# Altium project Wind_Power.PrjPCB
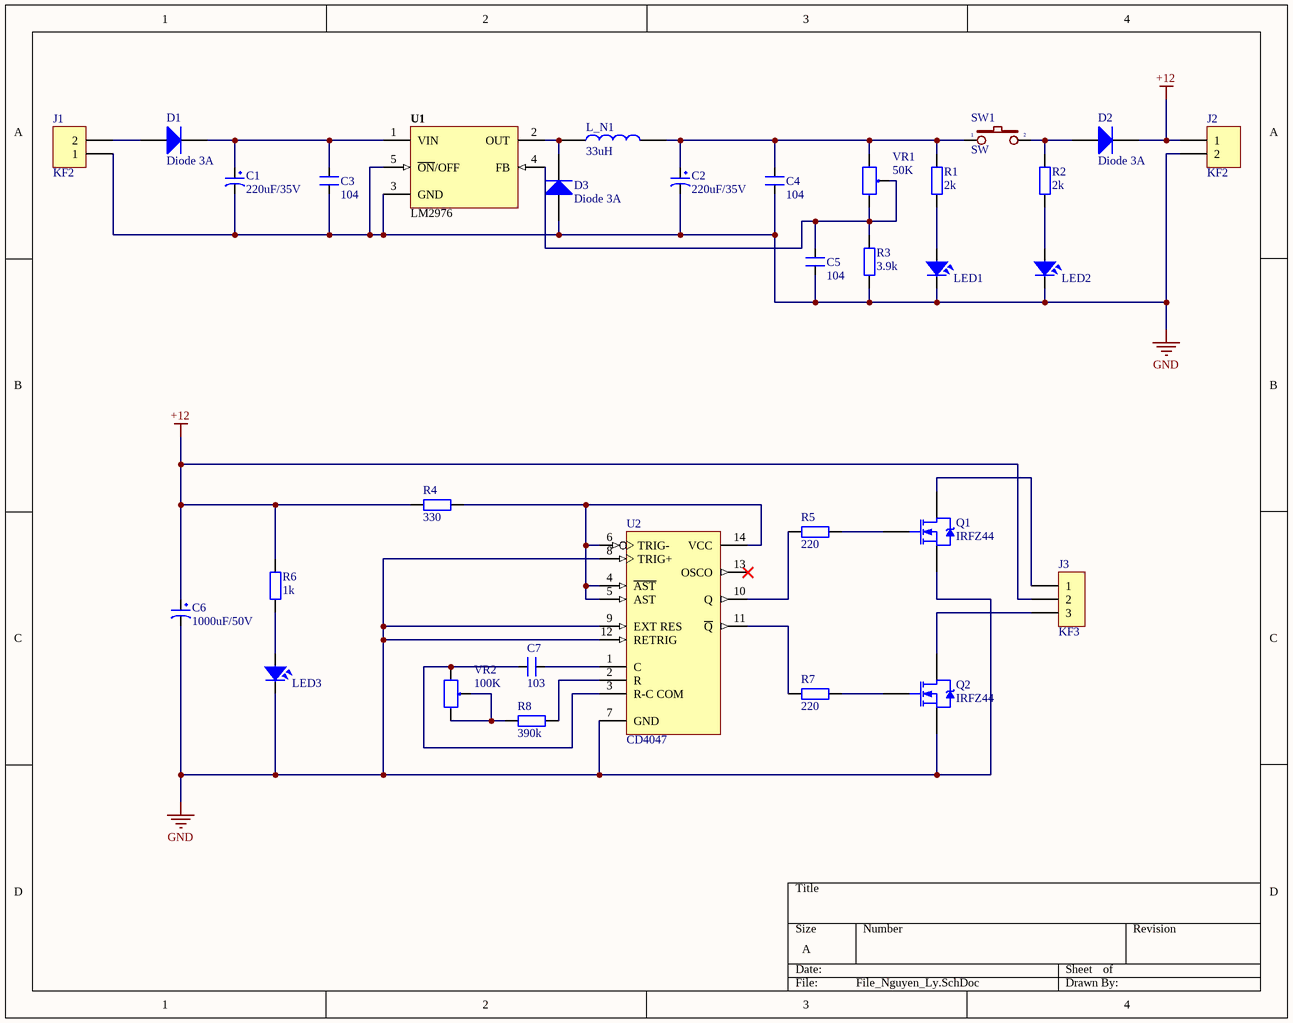
[diagram p0: File_Nguyen_Ly.SchDoc]
1 sheet, 32 parts. Net scope: global (net labels, ports and power ports of the same name join across sheets).
Board file: File_Mach_In.PcbDoc

## Sheet File_Nguyen_Ly.SchDoc
size A

### Parts
C1  220uF/35V  [CP1.5/3.4]
C2  220uF/35V  [CP1.5/3.4]
C3  104  [CN2]
C4  104  [CN2]
C5  104  [CN2]
C6  1000uF/50V  [CP2/4]
C7  103  [CN1.5]
D1  Diode 3A  [DIODE/POW/3A]
D2  Diode 3A  [DIODE/POW/3A]
D3  Diode 3A  [DIODE/POW/3A]
J1  KF2  [KF2-5.08]
J2  KF2  [KF2-7.62]
J3  KF3  [KF3-7.62]
L_N1  33uH  [100UH]
LED1  LED  [LED-5-Green]  (value not drawn)
LED2  LED  [LED-5-RED]  (value not drawn)
LED3  LED  [LED-5-BLUE]  (value not drawn)
Q1  IRFZ44  [TO220H2]
Q2  IRFZ44  [TO220H2]
R1  2k  [R1/4W]
R2  2k  [R1/4W]
R3  3.9k  [R1/4W]
R4  330  [R1/4W]
R5  220  [R1/2W]
R6  1k  [R1/4W]
R7  220  [R1/2W]
R8  390k  [R1/4W]
SW1  SW  [SW-DIP1-1]
U1  LM2976  [DIP5]
U2  CD4047  [DIP14/W0.3]
VR1  50K  [VR]
VR2  100K  [VR]

### Nets
+12: C6.1 D2.2(K) J2.1 J3.2 R4.2 R6.2
GND: C1.2 C2.2 C3.1 C4.1 C5.1 C6.2 D3.1(A) J1.1 J2.2 LED1.2 LED2.2 LED3.2 Q1.3(S) Q2.3(S) R3.1 U1.3(GND) U1.5(~{ON}/OFF) U2.7(GND) U2.8(TRIG+) U2.9(EXT_RES) U2.12(RETRIG)
NetC1_1: C1.1 C3.2 D1.2(K) U1.1(VIN)
NetC2_1: C2.1 C4.2 L_N1.2 R1.2 SW1.1 VR1.1
NetC5_2: C5.2 R3.2 U1.4(FB) VR1.2 VR1.3
NetC7_1: C7.1 U2.3(R-C_COM) VR2.1
NetC7_2: C7.2 U2.1(C)
NetD1_1: D1.1(A) J1.2
NetD2_1: D2.1(A) R2.2 SW1.2
NetD3_2: D3.2(K) L_N1.1 U1.2(OUT)
NetJ3_1: J3.1 Q1.2(D)
NetJ3_3: J3.3 Q2.2(D)
NetLED1_1: LED1.1 R1.1
NetLED2_1: LED2.1 R2.1
NetLED3_1: LED3.1 R6.1
NetQ1_1: Q1.1(G) R5.1
NetQ2_1: Q2.1(G) R7.1
NetR4_1: R4.1 U2.4(~{AST}) U2.5(AST) U2.6(TRIG-) U2.14(VCC)
NetR5_2: R5.2 U2.10(Q)
NetR7_2: R7.2 U2.11(~{Q})
NetR8_1: R8.1 U2.2(R)
NetR8_2: R8.2 VR2.2 VR2.3

Not connected (* = marked no-connect by the designer): U2 13(OSCO)*

### Library data of the parts
C1 C2 = CP3: Cap 100uF/35V - 470uF/16V; Value: 100uF/35V/50V; Description 1: 1000uF/6,3V - 470uF/16V - 330uF - 25V; Description 2: 220uF/35V - 100uF/50V - 63V - 4,7uF/200V; Description 3: 22uF => 33uF100V - 3,3uF => 4,7uF/250V; Description 4: 2,2uF =>3,3uF/350 - 2,2uF/400V - 1uF/450V
C3-C5 = CN2: Cap np 104 => 105pF; Value: 0.1uF
C6 = CP5: Cap 2200uF/16V - 1000uF/50V; Description 5: 47uF/200V - 22uF/350V - 400V - 10uF/450V; Description 1: 4700uF-6800uF/6,3V - 3300uF-4700uF/10V; Description 2: 2200uF-3300uF/16V - 470uF => 2200uF/25V; Description 3: 1000uF/35V-50V_470uF/63V_220uF>330uF/100V; Description 4: 47uF => 100uF/160V - 33uF-47uF/250V; Value: 2200uF/16V
C7 = CN1.5: Cap np 682pF => 104pF; Value: 0.01uF
D1-D3 = Diode Power 3A: Diode Power; Published: 8-Jun-2000; LatestRevisionDate: 17-Jul-2002; LatestRevisionNote: Re-released for DXP Platform.; DatasheetDocument: 1998; PackageDocument: Aug-1999; PackageReference: DO-201AD; Publisher: Altium Limited; ComponentLink1Description: Manufacturer Link; ComponentLink1URL: http://www.fairchildsemi.com/; ComponentLink2Description: Datasheet; ComponentLink2URL: http://www.fairchildsemi.com/ds/1N%2F1N5400.pdf
J1 J2 = KF2: Manufacturer: Würth Elektronik eiSos GmbH; partNo: 691103110002; ComponentLink1 Description: Manufacturer; ComponentLink2 Description: Datasheet; NoPins: 2; Created Date: 29 October 2013; ComponentLink1URL: http://www.we-online.com; ComponentLink2URL: http://katalog.we-online.de/em/datasheet/6911031100xx.pdf; Created by: Karrer Zheng
J3 = KF3: Manufacturer: Würth Elektronik eiSos GmbH; partNo: 691103110003; ComponentLink1 Description: Manufacturer; ComponentLink2 Description: Datasheet; NoPins: 3; Created Date: 29 October 2013; ComponentLink1URL: http://www.we-online.com; ComponentLink2URL: http://katalog.we-online.de/em/datasheet/6911031100xx.pdf; Created by: Karrer Zheng
L_N1 = INDUCTOR1
LED1-LED3 = LED: LED Single colour Green and Red; Value: LED 3 ly Single Colour
Q1 Q2 = IRFZ44: Value: IRF840
R1-R8 = R1/4W: Resistor 1/4W; Value: R1/4W - 1K
SW1 = SW2: Switch button 2 pin; Value: SW chip 2 pin
U1 = LM2596: Max Input Voltage: 12 V; Max Output Current: 3 (6.0 peak) A; Max Output Voltage: mV; Category: IC-Power; Min Input Voltage: mV; Min Output Voltage: mV; Mounting Technology: Surface Mount; Status: Unreleased; Supply Voltage: mV; Temperature Range: -40 to +125 degC
VR1 VR2 = VR: Var Resistor; Value: VR 10K